# Altium project DARKYDEN.PrjPcb (part 8 of 9)

## Sheet USB2_0.SchDoc: DARKYDEN_USBC2_0
size Letter; ApprovedBy: APPROUVÉ PAR; Author: Harold Malbrouck; Organization: Cegep Limoilou; Address1: 1300, 8e Avenue; Address2: Québec, QC; Address3: Canada; Address4: G1J 5L5; Revision: Rev.C; SheetNumber: 20; SheetTotal: 22
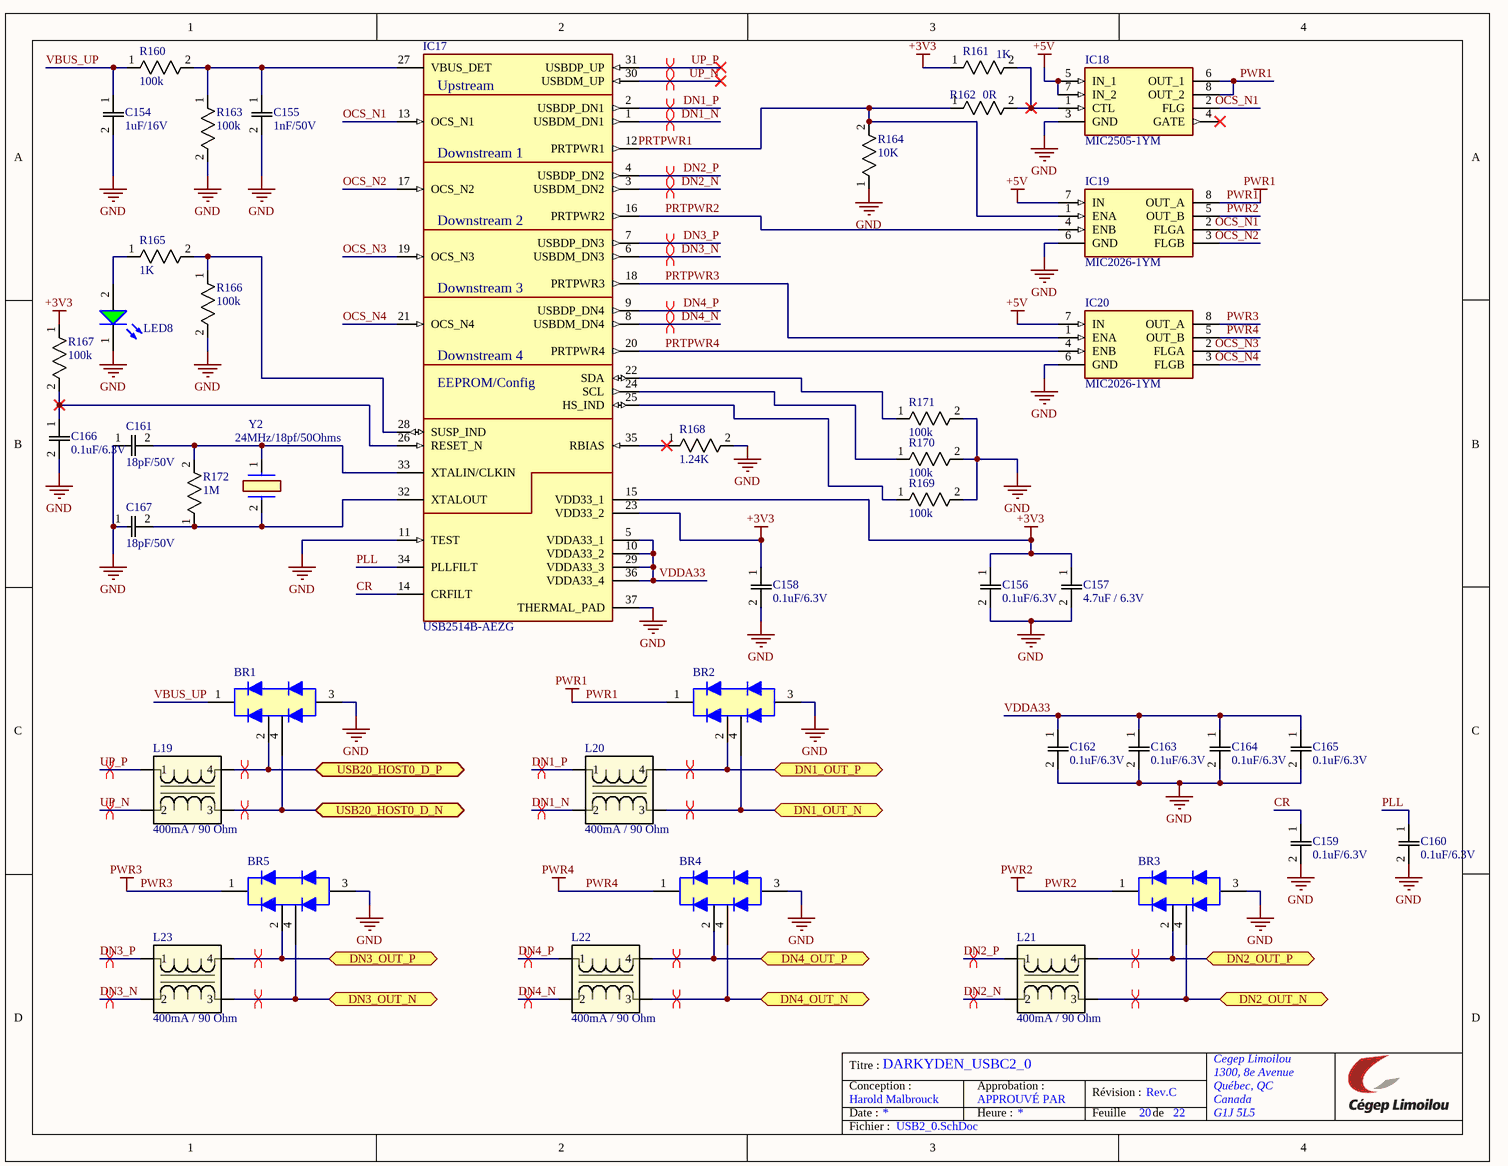
[diagram p9: USB2_0.SchDoc]

### Parts
BR1  BGX50AE6327HTSA1  [BF998215]  (value not drawn)
BR2  BGX50AE6327HTSA1  [BF998215]  (value not drawn)
BR3  BGX50AE6327HTSA1  [BF998215]  (value not drawn)
BR4  BGX50AE6327HTSA1  [BF998215]  (value not drawn)
BR5  BGX50AE6327HTSA1  [BF998215]  (value not drawn)
C154  1uF/16V  [C0805]
C155  1nF/50V  [C0805]
C156  0.1uF/6.3V  [C0805]
C157  4.7uF / 6.3V  [C0805]
C158  0.1uF/6.3V  [C0805]
C159  0.1uF/6.3V  [C0805]
C160  0.1uF/6.3V  [C0805]
C161  18pF/50V  [C0805]
C162  0.1uF/6.3V  [C0805]
C163  0.1uF/6.3V  [C0805]
C164  0.1uF/6.3V  [C0805]
C165  0.1uF/6.3V  [C0805]
C166  0.1uF/6.3V  [C0805]
C167  18pF/50V  [C0805]
IC17  USB2514B-AEZG  [QFN50P600X600X100-37N-D]
IC18  MIC2505-1YM  [SOIC127P599X173-8N]
IC19  MIC2026-1YM  [SOIC127P599X173-8N]
IC20  MIC2026-1YM  [SOIC127P599X173-8N]
L19  400mA / 90 Ohm  [ACM20129002PT002]
L20  400mA / 90 Ohm  [ACM20129002PT002]
L21  400mA / 90 Ohm  [ACM20129002PT002]
L22  400mA / 90 Ohm  [ACM20129002PT002]
L23  400mA / 90 Ohm  [ACM20129002PT002]
LED8  Green, 3.2V, 140°  [WL-SMCD_0603]  (value not drawn)
R160  100k  [RESC1608X55N]
R161  1K  [RESC1608X55N]
R162  0R  [RESC1608X55N]
R163  100k  [RESC1608X55N]
R164  10K  [RESC1608X55N]
R165  1K  [RESC1608X55N]
R166  100k  [RESC1608X55N]
R167  100k  [RESC1608X55N]
R168  1.24K  [RESC1608X55N]
R169  100k  [RESC1608X55N]
R170  100k  [RESC1608X55N]
R171  100k  [RESC1608X55N]
R172  1M  [RESC1608X55N]
Y2  24MHz/18pf/50Ohms  [HCM4924000000ABJT]

### Ports
DN1_OUT_N (bidir, see USB2_0_Connector[3A]), DN1_OUT_P (bidir, see USB2_0_Connector[3A]), DN2_OUT_N (bidir, see USB2_0_Connector[3B]), DN2_OUT_P (bidir, see USB2_0_Connector[3B]), DN3_OUT_N (bidir, see USB2_0_Connector[3C]), DN3_OUT_P (bidir, see USB2_0_Connector[3C]), DN4_OUT_N (bidir, see USB2_0_Connector[3C]), DN4_OUT_P (bidir, see USB2_0_Connector[3C]), USB20_HOST0_D_N (bidir, see CONNECTEUR_4[3A]), USB20_HOST0_D_P (bidir, see CONNECTEUR_4[3A])

### Nets
+3V3: C156.1 C157.1 C158.1 IC17.15(VDD33_1) IC17.23(VDD33_2) R161.1 R167.1
+5V: IC18.5(IN_1) IC18.7(IN_2) IC19.7(IN) IC20.7(IN)
GND: BR1.3(-) BR2.3(-) BR3.3(-) BR4.3(-) BR5.3(-) C154.2 C155.2 C156.2 C157.2 C158.2 C159.2 C160.2 C161.1 C162.2 C163.2 C164.2 C165.2 C166.2 C167.1 IC17.11(TEST) IC17.37(THERMAL_PAD) IC18.3(GND) IC19.6(GND) IC20.6(GND) LED8.1(K) R163.2 R164.1 R166.2 R168.2 R169.2 R170.2 R171.2  [project net AGND]
PWR1: BR2.1(+) IC18.6(OUT_1) IC18.8(OUT_2) IC19.8(OUT_A)
PWR2: BR3.1(+) IC19.5(OUT_B)
PWR3: BR5.1(+) IC20.8(OUT_A)
PWR4: BR4.1(+) IC20.5(OUT_B)
CR: C159.1 IC17.14(CRFILT)
DN1_N: IC17.1(USBDM_DN1) L20.2
DN1_OUT_N: BR2.4(~_2) L20.3 ; port DN1_OUT_N
DN1_OUT_P: BR2.2(~_1) L20.4 ; port DN1_OUT_P
DN1_P: IC17.2(USBDP_DN1) L20.1
DN2_N: IC17.3(USBDM_DN2) L21.2
DN2_OUT_N: BR3.4(~_2) L21.3 ; port DN2_OUT_N
DN2_OUT_P: BR3.2(~_1) L21.4 ; port DN2_OUT_P
DN2_P: IC17.4(USBDP_DN2) L21.1
DN3_N: IC17.6(USBDM_DN3) L23.2
DN3_OUT_N: BR5.4(~_2) L23.3 ; port DN3_OUT_N
DN3_OUT_P: BR5.2(~_1) L23.4 ; port DN3_OUT_P
DN3_P: IC17.7(USBDP_DN3) L23.1
DN4_N: IC17.8(USBDM_DN4) L22.2
DN4_OUT_N: BR4.4(~_2) L22.3 ; port DN4_OUT_N
DN4_OUT_P: BR4.2(~_1) L22.4 ; port DN4_OUT_P
DN4_P: IC17.9(USBDP_DN4) L22.1
OCS_N1: IC17.13(OCS_N1) IC18.2(FLG) IC19.2(FLGA)
OCS_N2: IC17.17(OCS_N2) IC19.3(FLGB)
OCS_N3: IC17.19(OCS_N3) IC20.2(FLGA)
OCS_N4: IC17.21(OCS_N4) IC20.3(FLGB)
PLL: C160.1 IC17.34(PLLFILT)
PRTPWR1: IC17.12(PRTPWR1) IC19.1(ENA) R162.1 R164.2
PRTPWR2: IC17.16(PRTPWR2) IC19.4(ENB)
PRTPWR3: IC17.18(PRTPWR3) IC20.1(ENA)
PRTPWR4: IC17.20(PRTPWR4) IC20.4(ENB)
UP_N: IC17.30(USBDM_UP) L19.2
UP_P: IC17.31(USBDP_UP) L19.1
USB20_HOST0_D_N: BR1.4(~_2) L19.3 ; port USB20_HOST0_D_N
USB20_HOST0_D_P: BR1.2(~_1) L19.4 ; port USB20_HOST0_D_P
VBUS_UP: BR1.1(+) C154.1 R160.1
VDDA33: C162.1 C163.1 C164.1 C165.1 IC17.5(VDDA33_1) IC17.10(VDDA33_2) IC17.29(VDDA33_3) IC17.36(VDDA33_4)
NetC155_1: C155.1 IC17.27(VBUS_DET) R160.2 R163.1
NetC161_2: C161.2 IC17.33(XTALIN/CLKIN) R172.2 Y2.1
NetC166_1: C166.1 IC17.26(RESET_N) R167.2
NetC167_2: C167.2 IC17.32(XTALOUT) R172.1 Y2.2(CRYSTAL_2)
NetIC17_22: IC17.22(SDA) R171.1
NetIC17_24: IC17.24(SCL) R170.1
NetIC17_25: IC17.25(HS_IND) R169.1
NetIC17_28: IC17.28(SUSP_IND) R165.2 R166.1
NetIC17_35: IC17.35(RBIAS) R168.1
NetIC18_1: IC18.1(CTL) R161.2 R162.2
NetLED8_2: LED8.2(A) R165.1

Not connected (* = marked no-connect by the designer): IC18 4(GATE)*

### Layout directives
differential pair: DN1_N, DN1_OUT_N, DN1_OUT_P, DN1_P, DN2_N, DN2_OUT_N, DN2_OUT_P, DN2_P, DN3_N, DN3_OUT_N, DN3_OUT_P, DN3_P, DN4_N, DN4_OUT_N, DN4_OUT_P, DN4_P, UP_N, UP_P, USB20_HOST0_D_N, USB20_HOST0_D_P

### Notes on the sheet
- Titre :
- Conception :
- Date :
- Approbation :
- Heure :
- Révision :
- Feuille
- de
- Fichier :
- (in symbol USB2514B-AEZG) Upstream; Downstream 1; Downstream 2; Downstream 3; Downstream 4; EEPROM/Config

### Library data of the parts
BR1-BR5 = BGX50AE6327HTSA1: BGX50A Series 50 V 140 mA Surface Mount Silicon Switching Diode - SOT-143; Manufacturer_Name: Infineon; Forward Current: 140mA; Forward Voltage: 1.3V; Max Repetitive Reverse Voltage (Vrrm): 70V; Reverse Recovery Time: 6ns; Voltage Rating (DC): 50V; Value: 1.5pF; Max Reverse Current: 200nA; Datasheet Link: https://www.infineon.com/dgdl/Infineon-BGX50ASERIES-DS-v01_01-en.pdf?fileId=db3a30431400ef6801141cc423c404e9; Manufacturer_Part_Number: BGX50AE6327HTSA1; Mouser Part Number: 726-BGX50AE6327HTSA1; Mouser Price/Stock: https://www.mouser.co.uk/ProductDetail/Infineon-Technologies/BGX50AE6327HTSA1?qs=K00xGehIljtICzjrsCDc8w%3D%3D; Arrow Part Number: BGX50AE6327HTSA1; Arrow Price/Stock: https://www.arrow.com/en/products/bgx50ae6327htsa1/infineon-technologies-ag?utm_currency=USD&region=europe; Supplier: Digikey; Supplier Part Number: BGX50AE6327HTSA1CT-ND; Manufacturer: Infineon; Manufacturer Part Number: BGX50AE6327HTSA1; RoHS: Yes; Category: Rectifier Diodes; Stock: 90032; Pricing: 1=0.42, 10=0.266, 100=0.1782, 500=0.13332, 1000=0.1188 (USD); Mounting Technology: Surface Mount; Case/Package: SOT-143-4; Pins: 4; Min Operating Temperature: -65°C; Max Operating Temperature: 150°C; Packaging: Tape and Reel; Series: -; Current Rating: 140mA; Package Quantity: 3000NUMBER; Reverse Voltage: 50V; Length: 2.9mm; Width: 1.3mm; Height: 1.1mm; Radiation Hardening: No; RoHS Compliant: Yes; Lead Free: Lead Free; Halogen Free: Not Halogen Free; Reach SVHC Compliant: 4186SVHC; ComponentLink1URL: http://www.farnell.com/datasheets/1835970.pdf?src-supplier=Farnell; ComponentLink1Description: http://www.farnell.com/datasheets/1835970.pdf?src-supplier=Farnell; ComponentLink2URL: http://uk.rs-online.com/webdocs/132f/0900766b8132f01b.pdf?src-supplier=Rs; ComponentLink2Description: http://uk.rs-online.com/webdocs/132f/0900766b8132f01b.pdf?src-supplier=Rs; ComponentLink3URL: http://components.arrow.com/part/dataview/52117287S9850481N2051?src-supplier=Arrow+Electronics; ComponentLink3Description: http://components.arrow.com/part/dataview/52117287S9850481N2051?src-supplier=Arrow+Electronics; ComponentLink4URL: https://datasheet.octopart.com/BGX50AE6327HTSA1-Infineon-datasheet-180052998.pdf?src-supplier=Element14; ComponentLink4Description: https://datasheet.octopart.com/BGX50AE6327HTSA1-Infineon-datasheet-180052998.pdf?src-supplier=Element14; ComponentLink5URL: http://documents.rs-components.com/techlib://itc_doclist_GB.htm?stockno=0287342A&src-supplier=Rs; ComponentLink5Description: http://documents.rs-components.com/techlib://itc_doclist_GB.htm?stockno=0287342A&src-supplier=Rs; ComponentLink6URL: http://datasheet.octopart.com/BGX50AE6327HTSA1-Infineon-datasheet-5392290.pdf?src-supplier=Future+Electronics; ComponentLink6Description: http://datasheet.octopart.com/BGX50AE6327HTSA1-Infineon-datasheet-5392290.pdf?src-supplier=Future+Electronics; ComponentLink7URL: http://www.farnell.com/datasheets/1835970.pdf?src-supplier=Newark; ComponentLink7Description: http://www.farnell.com/datasheets/1835970.pdf?src-supplier=Newark; ComponentLink8URL: http://datasheet.octopart.com/BGX50AE6327HTSA1-Infineon-datasheet-5392290.pdf?src-supplier=Mouser; ComponentLink8Description: http://datasheet.octopart.com/BGX50AE6327HTSA1-Infineon-datasheet-5392290.pdf?src-supplier=Mouser; ComponentLink9URL: http://www.infineon.com/dgdl/bgx50aseries.pdf?folderId=db3a30431400ef6801141cc1c4cd04e8&fileId=db3a30431400ef6801141cc423c404e9&src-supplier=Avnet; ComponentLink9Description: http://www.infineon.com/dgdl/bgx50aseries.pdf?folderId=db3a30431400ef6801141cc1c4cd04e8&fileId=db3a30431400ef6801141cc423c404e9&src-supplier=Avnet
C154 = C0805C105K4RACTU: 1uF/16 V, X7R, Surface Mount, 0805; Manufacturer_Name: KEMET; Material: 4241ConductorMaterial; Value: 1uF; Tolerance: 10%; Voltage Rating (DC): 16V; Datasheet Link: https://content.kemet.com/datasheets/KEM_C1002_X7R_SMD.pdf; Height: 1.1mm; Manufacturer_Part_Number: C0805C105K4RACTU; Mouser Part Number: 80-C0805C105K4R; Mouser Price/Stock: https://www.mouser.co.uk/ProductDetail/KEMET/C0805C105K4RACTU?qs=yrVqjCObULOefkidH6lLLQ%3D%3D; Arrow Part Number: C0805C105K4RACTU; Arrow Price/Stock: https://www.arrow.com/en/products/c0805c105k4ractu/kemet-corporation?utm_currency=USD&region=nac; Supplier: Digikey; Supplier Part Number: 399-C0805C105K4RACTUCT-ND; Manufacturer: KEMET; Manufacturer Part Number: C0805C105K4RACTU; RoHS: Yes; Category: Ceramic Capacitors; Stock: 422443; Pricing: 1=0.12, 10=0.068, 100=0.041, 1000=0.04021, 2500=0.02182, 5000=0.02051, 7500=0.02038, 12500=0.01866, 17500=0.01858, 25000=0.01797, 62500=0.01676, 125000=0.01602, 250000=0.01544 (USD); Mounting Technology: Surface Mount,PCB; Case/Package: 0805; Pins: 2; Case Code (Metric): 2012; Case Code (Imperial): 0805; Min Operating Temperature: -55°C; Max Operating Temperature: 125°C; Packaging: Tape and Reel; Dielectric: X7R; Package Quantity: 1; Voltage Rating: 16V; Termination: SMD/SMT; Series: SMD Comm X7R; Construction: Flat; Voltage: 16V; Voltage Rating (AC): 16V; Length: 2mm; Width: 0.049inch; Thickness: 0.039inch; Depth: 1.25mm; Radiation Hardening: No; Reach SVHC Compliant: No; RoHS Compliant: Yes; Lead Free: 5697LeadFree; ComponentLink1URL: https://datasheet.ciiva.com/6074/1722731-6074364.pdf?src-supplier=Farnell; ComponentLink1Description: https://datasheet.ciiva.com/6074/1722731-6074364.pdf?src-supplier=Farnell; ComponentLink2URL: https://datasheet.ciiva.com/39122/docfinderpartnumberc0402c102k5ractu-39122926.pdf?src-supplier=Onlinecomponents.com; ComponentLink2Description: https://datasheet.ciiva.com/39122/docfinderpartnumberc0402c102k5ractu-39122926.pdf?src-supplier=Onlinecomponents.com; ComponentLink3URL: https://datasheet.ciiva.com/45846/docfinderpartnumberc0402c102k5ractu-45846934.pdf?src-supplier=Onlinecomponents.com; ComponentLink3Description: https://datasheet.ciiva.com/45846/docfinderpartnumberc0402c102k5ractu-45846934.pdf?src-supplier=Onlinecomponents.com; ComponentLink4URL: https://datasheet.ciiva.com/18193/getdatasheetpartid-331279-18193467.pdf?src-supplier=Verical; ComponentLink4Description: https://datasheet.ciiva.com/18193/getdatasheetpartid-331279-18193467.pdf?src-supplier=Verical; ComponentLink5URL: https://datasheet.ciiva.com/14585/70095383-14585511.pdf?src-supplier=Allied+Electronics; ComponentLink5Description: https://datasheet.ciiva.com/14585/70095383-14585511.pdf?src-supplier=Allied+Electronics; ComponentLink6URL: https://datasheet.ciiva.com/14603/70095383-14603388.pdf?src-supplier=Allied+Electronics; ComponentLink6Description: https://datasheet.ciiva.com/14603/70095383-14603388.pdf?src-supplier=Allied+Electronics; ComponentLink7URL: https://datasheet.ciiva.com/28692/1851736-28692942.pdf?src-supplier=Element14; ComponentLink7Description: https://datasheet.ciiva.com/28692/1851736-28692942.pdf?src-supplier=Element14
C155 = C0805C102K5RACTU: Multilayer Ceramic Capacitor 1000 Pf 50 V ½ 10% X7R 0805 [2012 Metric]; Manufacturer_Name: KEMET; Manufacturer_Part_Number: C0805C102K5RAC-TU; Dielectric Material: 4241ConductorMaterial; Value: 1nF; Voltage Rating (DC): 50V; Temperature Coefficient: 30ppm/°C; Datasheet Link: https://componentsearchengine.com/Datasheets/2/C0805C102K5RAC-TU.pdf; Height: 0.88mm; Supplier: Digikey; Supplier Part Number: 399-C0805C102K5RACTUCT-ND; Manufacturer: KEMET; Manufacturer Part Number: C0805C102K5RACTU; RoHS: Yes; Category: Ceramic Capacitors; Stock: 137971; Pricing: 1=0.11, 10=0.06, 100=0.0358, 1000=0.0235 (USD); Mounting Technology: Surface Mount,PCB; Case/Package: 0805; Pins: 2; Case Code (Imperial): 0805; Case Code (Metric): 2012; Material: 4241ConductorMaterial; Min Operating Temperature: -55°C; Max Operating Temperature: 125°C; Tolerance: 10%; Packaging: Tape and Reel; Dielectric: X7R; Voltage: 50V; Series: SMD Comm X7R; Voltage Rating: 50V; Package Quantity: 4000; Termination: SMD/SMT; Construction: Flat; Length: 2mm; Width: 1.25mm; Lead Pitch: 0.75mm; Depth: 1.25mm; Thickness: 889um; Radiation Hardening: No; Reach SVHC Compliant: No; RoHS Compliant: Yes; Lead Free: 5697LeadFree; ComponentLink1URL: https://datasheet.ciiva.com/18193/getdatasheetpartid-385640-18193338.pdf?src-supplier=Verical; ComponentLink1Description: https://datasheet.ciiva.com/18193/getdatasheetpartid-385640-18193338.pdf?src-supplier=Verical; ComponentLink2URL: https://datasheet.ciiva.com/39122/docfinderpartnumberc0402c102k5ractu-39122922.pdf?src-supplier=Onlinecomponents.com; ComponentLink2Description: https://datasheet.ciiva.com/39122/docfinderpartnumberc0402c102k5ractu-39122922.pdf?src-supplier=Onlinecomponents.com; ComponentLink3URL: https://datasheet.ciiva.com/7842/1918693-7842527.pdf?src-supplier=Element14; ComponentLink3Description: https://datasheet.ciiva.com/7842/1918693-7842527.pdf?src-supplier=Element14
C156 C158-C160 C162-C166 = C0805C104K9RACTU: 0.1uF 6.3V X7R 10% Pad SMD 0805 125C T/R; Manufacturer_Name: KEMET; Dielectric Material: Ceramic; Material: 4241ConductorMaterial; Value: 100nF; Datasheet Link: https://content.kemet.com/datasheets/KEM_C1002_X7R_SMD.pdf; Height: 1.1mm; Manufacturer_Part_Number: C0805C104K9RACTU; Mouser Part Number: 80-C0805C104K9R; Mouser Price/Stock: https://www.mouser.co.uk/ProductDetail/KEMET/C0805C104K9RACTU?qs=jbCUrP3sAgRYLjBU7s5h8Q%3D%3D; Arrow Part Number: C0805C104K9RACTU; Arrow Price/Stock: https://www.arrow.com/en/products/c0805c104k9ractu/kemet-corporation; Supplier: Digikey; Supplier Part Number: 399-C0805C104K9RACTUCT-ND; Manufacturer: KEMET; Manufacturer Part Number: C0805C104K9RACTU; RoHS: Yes; Category: Ceramic Capacitors; Stock: 68008; Pricing: 1=0.21, 10=0.214, 100=0.1506, 1000=0.11154 (USD); Mounting Technology: Surface Mount; Case/Package: 0805; Case Code (Metric): 2012; Case Code (Imperial): 0805; Min Operating Temperature: -55°C; Max Operating Temperature: 125°C; Package Quantity: 4000; Voltage Rating: 6.3V; Tolerance: 10%; Packaging: Tape and Reel; Voltage Rating (DC): 6.3V; Dielectric: X7R; Termination: SMD/SMT; Series: SMD Comm X7R; Construction: Flat; Length: 2mm; Width: 1.2mm; Thickness: 0.039inch; Depth: 1.25mm; Radiation Hardening: No; RoHS Compliant: Yes; ComponentLink1URL: http://www.farnell.com/datasheets/2746329.pdf?src-supplier=Farnell; ComponentLink1Description: http://www.farnell.com/datasheets/2746329.pdf?src-supplier=Farnell; ComponentLink2URL: http://www.mouser.com/ds/2/212/KEM_C1002_X7R_SMD-1102033.pdf?src-supplier=Mouser; ComponentLink2Description: http://www.mouser.com/ds/2/212/KEM_C1002_X7R_SMD-1102033.pdf?src-supplier=Mouser; ComponentLink3URL: http://datasheet.octopart.com/C0805C104K9RACTU-KEMET-datasheet-157246124.pdf?src-supplier=Avnet; ComponentLink3Description: http://datasheet.octopart.com/C0805C104K9RACTU-KEMET-datasheet-157246124.pdf?src-supplier=Avnet; ComponentLink4URL: http://datasheet.octopart.com/C0805C104K9RACTU-KEMET-datasheet-157246124.pdf?src-supplier=Onlinecomponents.com; ComponentLink4Description: http://datasheet.octopart.com/C0805C104K9RACTU-KEMET-datasheet-157246124.pdf?src-supplier=Onlinecomponents.com; ComponentLink5URL: http://capacitoredge.kemet.com/capedge2/DataSheet?pn=C0805C104K9RACTU&src-supplier=Avnet; ComponentLink5Description: http://capacitoredge.kemet.com/capedge2/DataSheet?pn=C0805C104K9RACTU&src-supplier=Avnet; ComponentLink6URL: http://www.farnell.com/datasheets/2746329.pdf?src-supplier=Newark; ComponentLink6Description: http://www.farnell.com/datasheets/2746329.pdf?src-supplier=Newark; ComponentLink7URL: http://datasheet.octopart.com/C0805C104K9RACTU-KEMET-datasheet-157246124.pdf?src-supplier=Digikey; ComponentLink7Description: http://datasheet.octopart.com/C0805C104K9RACTU-KEMET-datasheet-157246124.pdf?src-supplier=Digikey; ComponentLink8URL: https://api.kemet.com/component-edge/download/datasheet/C0805C104K9RACTU.pdf?src-supplier=Digikey; ComponentLink8Description: https://api.kemet.com/component-edge/download/datasheet/C0805C104K9RACTU.pdf?src-supplier=Digikey; ComponentLink9URL: https://datasheet.octopart.com/C0805C104K9RACTU.-KEMET-datasheet-179056791.pdf?src-supplier=Element14; ComponentLink9Description: https://datasheet.octopart.com/C0805C104K9RACTU.-KEMET-datasheet-179056791.pdf?src-supplier=Element14; ComponentLink10URL: https://datasheet.octopart.com/C0805C104K9RACTU-KEMET-datasheet-137357759.pdf?src-supplier=Farnell; ComponentLink10Description: https://datasheet.octopart.com/C0805C104K9RACTU-KEMET-datasheet-137357759.pdf?src-supplier=Farnell; ComponentLink11URL: http://www.farnell.com/datasheets/2746329.pdf?src-supplier=Element14; ComponentLink11Description: http://www.farnell.com/datasheets/2746329.pdf?src-supplier=Element14; ComponentLink12URL: https://datasheet.octopart.com/C0805C104K9RACTU-KEMET-datasheet-157246124.pdf?src-supplier=TME; ComponentLink12Description: https://datasheet.octopart.com/C0805C104K9RACTU-KEMET-datasheet-157246124.pdf?src-supplier=TME; ComponentLink13URL: http://datasheet.octopart.com/C0805C104K9RACTU-KEMET-datasheet-157246124.pdf?src-supplier=TTI; ComponentLink13Description: http://datasheet.octopart.com/C0805C104K9RACTU-KEMET-datasheet-157246124.pdf?src-supplier=TTI; ComponentLink14URL: http://datasheet.octopart.com/C0805C104K9RACTU-KEMET-datasheet-157246124.pdf?src-supplier=Electro+Sonic; ComponentLink14Description: http://datasheet.octopart.com/C0805C104K9RACTU-KEMET-datasheet-157246124.pdf?src-supplier=Electro+Sonic
C157 = C0805C475K9RACTU: 4.7uF 6.3V X7R 10% Pad SMD 0805 125C T/R; Manufacturer_Name: KEMET; Dielectric Material: Ceramic; Datasheet Link: https://content.kemet.com/datasheets/KEM_C1002_X7R_SMD.pdf; Height: 1.1mm; Manufacturer_Part_Number: C0805C475K9RACTU; Mouser Part Number: 80-C0805C475K9R; Mouser Price/Stock: https://www.mouser.co.uk/ProductDetail/KEMET/C0805C475K9RACTU?qs=iP0bYSAMAFr1bFRzk5G%2Fsg%3D%3D; Arrow Part Number: C0805C475K9RACTU; Arrow Price/Stock: https://www.arrow.com/en/products/c0805c475k9ractu/kemet-corporation?region=nac; Supplier: Digikey; Supplier Part Number: 399-C0805C475K9RACTUCT-ND; Manufacturer: KEMET; Manufacturer Part Number: C0805C475K9RACTU; RoHS: Yes; Category: Ceramic Capacitors; Stock: 8898; Pricing: 1=0.47, 10=0.287, 100=0.2342, 1000=0.19866 (USD); Mounting Technology: Surface Mount; Case/Package: 0805; Case Code (Metric): 2012; Case Code (Imperial): 0805; Material: Ceramic; Min Operating Temperature: -55°C; Max Operating Temperature: 125°C; Package Quantity: 1; Value: 4.7uF; Voltage Rating: 6.3V; Tolerance: 10%; Packaging: Tape and Reel; Voltage Rating (DC): 6.3V; Termination: SMD/SMT; Series: C; Length: 0.079inch; Width: 0.049inch; Thickness: 0.055inch; RoHS Compliant: Yes; ComponentLink1URL: https://datasheet.ciiva.com/5410/kem-c1002-x7r-smd-5410071.pdf?src-supplier=Mouser; ComponentLink1Description: https://datasheet.ciiva.com/5410/kem-c1002-x7r-smd-5410071.pdf?src-supplier=Mouser
C161 C167 = C0805C180K5RACTU: 18PF, 50V, Mlcc, 0805;; Manufacturer_Name: KEMET; Dielectric Material: 4241ConductorMaterial; Dielectric: 1511DielectricType; Datasheet Link: https://content.kemet.com/datasheets/KEM_C1002_X7R_SMD.pdf; Height: 1.1mm; Manufacturer_Part_Number: C0805C180K5RACTU; Supplier: Digikey; Supplier Part Number: 399-C0805C180K5RACTUCT-ND; Manufacturer: KEMET; Manufacturer Part Number: C0805C180K5RACTU; RoHS: Yes; Category: Ceramic Capacitors; Stock: 4917; Pricing: 1=0.22, 10=0.124, 100=0.078, 1000=0.05429 (USD); Case/Package: 339Case; Value: 18pF; Voltage Rating (DC): 50V; RoHS Compliant: Yes; ComponentLink1URL: https://datasheet.octopart.com/C0805C180K5RACTU-KEMET-datasheet-149524058.pdf?src-supplier=Farnell; ComponentLink1Description: https://datasheet.octopart.com/C0805C180K5RACTU-KEMET-datasheet-149524058.pdf?src-supplier=Farnell
IC17 = USB2514B-AEZG: USB Hub Controller USB 2.0 USB Interface 36-QFN (6x6); Manufacturer_Name: Microchip; Datasheet Link: http://ww1.microchip.com/downloads/en/DeviceDoc/00001692C.pdf; Height: 1mm; Manufacturer_Part_Number: USB2514B-AEZG; Mouser Part Number: 886-USB2514B-AEZG; Mouser Price/Stock: https://www.mouser.co.uk/ProductDetail/Microchip-Technology/USB2514B-AEZG?qs=ydWXD%252B8LvLCxuNqQPTEcVA%3D%3D; Arrow Part Number: USB2514B-AEZG; Arrow Price/Stock: https://www.arrow.com/en/products/usb2514b-aezg/microchip-technology?utm_currency=USD&region=nac
IC18 = MIC2505-1YM: Power Switch/Driver 1:1 N-Channel 2A 8-SOIC; Manufacturer_Name: Microchip; Datasheet Link: http://ww1.microchip.com/downloads/en/DeviceDoc/20005579A.pdf; Height: 1.73mm; Manufacturer_Part_Number: MIC2505-1YM; Mouser Part Number: 998-MIC2505-1YM; Mouser Price/Stock: https://www.mouser.co.uk/ProductDetail/Microchip-Technology/MIC2505-1YM?qs=aiLzH1moG334fyRlF%2FjkOA%3D%3D; Arrow Part Number: MIC2505-1YM; Arrow Price/Stock: https://www.arrow.com/en/products/mic2505-1ym/microchip-technology?region=nac
IC19 IC20 = MIC2026-1YM: Power Switch/Driver 1:2 N-Channel 1.25A 8-SOIC; Manufacturer_Name: Microchip; Datasheet Link: https://datasheet.datasheetarchive.com/originals/distributors/Datasheets_SAMA/de61a94af7af6e146ce4ec6120a88ebf.pdf; Height: 1.73mm; Manufacturer_Part_Number: MIC2026-1YM; Mouser Part Number: 998-MIC2026-1YM; Mouser Price/Stock: https://www.mouser.co.uk/ProductDetail/Microchip-Technology/MIC2026-1YM?qs=fCMQZLq47kXY18AAaO6axw%3D%3D; Arrow Part Number: MIC2026-1YM; Arrow Price/Stock: https://www.arrow.com/en/products/mic2026-1ym/microchip-technology?utm_currency=USD&region=nac
L19-L23 = ACM2012-900-2P-T002: Ferrite Beads Wirewound Common Mode Filter 90Ohm 100MHz 400mA 0805 T/R; Manufacturer_Name: TDK; Impedance: 90R; Voltage Rating: 50V; Number of Lines: 2; DC Resistance (DCR): 190mR; Shielding: Shielded; Datasheet Link: https://product.tdk.com/system/files/dam/doc/product/emc/emc/cmf_cmc/catalog/cmf_commercial_signal_acm2012_en.pdf; Height: 1.3mm; Manufacturer_Part_Number: ACM2012-900-2P-T002; Mouser Part Number: 810-ACM20129002PT002; Mouser Price/Stock: https://www.mouser.co.uk/ProductDetail/TDK/ACM2012-900-2P-T002?qs=vhEaPADELPHXWaCJFQVZjQ%3D%3D; Arrow Part Number: ACM2012-900-2P-T002; Arrow Price/Stock: https://www.arrow.com/en/products/acm2012-900-2p-t002/tdk?utm_currency=USD&region=europe; Supplier: Digikey; Supplier Part Number: 445-2207-1-ND; Manufacturer: TDK; Manufacturer Part Number: ACM2012-900-2P-T002; RoHS: Yes; Category: Common Mode Chokes; Stock: 26254; Pricing: 1=0.34, 10=0.277, 25=0.2564, 50=0.2416, 100=0.2278, 250=0.21076, 500=0.1987, 1000=0.18735 (USD); Mounting Technology: Surface Mount; Case/Package: 0805; Pins: 4; Case Code (Metric): 2012; Case Code (Imperial): 0805; Core Material: Ferrite; Min Operating Temperature: -40°C; Max Operating Temperature: 85°C; Packaging: Tape and Reel; Package Quantity: 1; Voltage Rating (DC): 50V; Current Rating: 400mA; Max DC Current: 400mA; Termination: SMD/SMT; Test Frequency: 100MHz; Current: 400mA; DC Current: 400mA; Series: ACM; DC Resistance-Max: 190mR; Max Current Rating: 400mA; RMS Current (Irms): 400mA; ESR: 190mR; Coil Resistance: 190mR; Length: 2.2mm; Width: 0.047inch; Depth: 1.4mm; Radiation Hardening: No; Reach SVHC Compliant: No; Military Standard: Not; RoHS Compliant: Yes; Lead Free: 5697LeadFree; ComponentLink1URL: https://datasheet.ciiva.com/26946/getdatasheetpartid-664745-26946491.pdf?src-supplier=Verical; ComponentLink1Description: https://datasheet.ciiva.com/26946/getdatasheetpartid-664745-26946491.pdf?src-supplier=Verical; ComponentLink2URL: https://datasheet.ciiva.com/1127/1750020-1127257.pdf?src-supplier=Element14; ComponentLink2Description: https://datasheet.ciiva.com/1127/1750020-1127257.pdf?src-supplier=Element14; ComponentLink3URL: https://datasheet.ciiva.com/22726/1750020-22726278.pdf?src-supplier=Element14; ComponentLink3Description: https://datasheet.ciiva.com/22726/1750020-22726278.pdf?src-supplier=Element14; ComponentLink4URL: https://datasheet.ciiva.com/28428/1750020-28428616.pdf?src-supplier=Element14; ComponentLink4Description: https://datasheet.ciiva.com/28428/1750020-28428616.pdf?src-supplier=Element14; ComponentLink5URL: https://datasheet.ciiva.com/46450/1750020-46450939.pdf?src-supplier=Element14; ComponentLink5Description: https://datasheet.ciiva.com/46450/1750020-46450939.pdf?src-supplier=Element14; ComponentLink6URL: https://datasheet.ciiva.com/1007/e9712-acm-1007624.pdf?src-supplier=Digikey; ComponentLink6Description: https://datasheet.ciiva.com/1007/e9712-acm-1007624.pdf?src-supplier=Digikey; ComponentLink7URL: https://datasheet.ciiva.com/1007/e9712-acm-1007623.pdf?src-supplier=Digikey; ComponentLink7Description: https://datasheet.ciiva.com/1007/e9712-acm-1007623.pdf?src-supplier=Digikey; ComponentLink8URL: https://datasheet.ciiva.com/1007/e9712-acm-1007625.pdf?src-supplier=Digikey; ComponentLink8Description: https://datasheet.ciiva.com/1007/e9712-acm-1007625.pdf?src-supplier=Digikey; ComponentLink9URL: https://datasheet.ciiva.com/4941/tdk-e9712-acm-332263-4941941.pdf?src-supplier=Mouser; ComponentLink9Description: https://datasheet.ciiva.com/4941/tdk-e9712-acm-332263-4941941.pdf?src-supplier=Mouser; ComponentLink10URL: https://datasheet.ciiva.com/16416/e9712-acm-16416522.pdf?src-supplier=Future+Electronics; ComponentLink10Description: https://datasheet.ciiva.com/16416/e9712-acm-16416522.pdf?src-supplier=Future+Electronics; ComponentLink11URL: https://datasheet.ciiva.com/8498/e9712-acm-8498823.pdf?src-supplier=Avnet; ComponentLink11Description: https://datasheet.ciiva.com/8498/e9712-acm-8498823.pdf?src-supplier=Avnet; ComponentLink12URL: https://datasheet.ciiva.com/16382/e9712-acm-16382582.pdf?src-supplier=Future+Electronics; ComponentLink12Description: https://datasheet.ciiva.com/16382/e9712-acm-16382582.pdf?src-supplier=Future+Electronics
LED8 = GREEN: WL-SMCD Mono-color Chip LED Diffused, SMT, size 0603, Green, 3.2V, 140°; Manufacturer Part Number: 150060GS55040; Manufacturer: Wurth Elektronik; Case/Size Code: 0603; Chip Technology: InGaN; Dominant Wavelength: 525nm; Luminous Intensity: 430mcd; Peak Wavelength: 520nm; Category: Signal LEDs; Match Code: WL-SMCD; ComponentLink1Description: Website Link; ComponentLink1URL: https://www.we-online.com/redexpert/article/150060GS55040?ad; ComponentLink2Description: Datasheet Link; ComponentLink2URL: https://www.we-online.com/redexpert/spec/150060GS55040?ad; Mount: Surface Mount; Operating Temperature Max: 85°C; Operating Temperature Min: -40°C; Packaging: Tape and Reel; Length: 1.6mm; Width: 0.8mm; Height: 0.4mm; Emitting Color: Green; Forward Voltage: 3.2V; Viewing Angle: 140°
R160 R163 R166 R167 R169-R171 = ERJ-3GEYJ104V: 100K Ohm 5%  Res Thick Film 0603 1/10W +/-200ppm/ßC Molded SMD Punched Carrier T/R; Manufacturer_Name: Panasonic; Value: 100kR; Power Rating: 100mW; Voltage Rating: 75V; Temperature Coefficient: 200ppm/°C; Voltage Rating (DC): 50V; Datasheet Link: http://docs-europe.electrocomponents.com/webdocs/13ba/0900766b813ba21b.pdf; Height: 0.55mm; Manufacturer_Part_Number: ERJ-3GEYJ104V; Mouser Part Number: 667-ERJ-3GEYJ104V; Mouser Price/Stock: https://www.mouser.co.uk/ProductDetail/Panasonic/ERJ-3GEYJ104V?qs=66DK8nO8gJC7IhSuep78kw%3D%3D; Arrow Part Number: ERJ-3GEYJ104V; Arrow Price/Stock: https://www.arrow.com/en/products/erj-3geyj104v/panasonic?region=nac; Supplier: Digikey; Supplier Part Number: P100KGCT-ND; Manufacturer: Panasonic; Manufacturer Part Number: ERJ-3GEYJ104V; RoHS: Yes; Category: Chip SMD Resistors; Stock: 248896; Pricing: 1=0.1, 10=0.033, 50=0.02, 100=0.0165, 500=0.01096, 1000=0.00939 (USD); Mounting Technology: Surface Mount; Case/Package: 0603; Case Code (Imperial): 0603; Case Code (Metric): 1608; Weight: 7.1E-05oz; Contact Plating: Tin; Min Operating Temperature: -55°C; Max Operating Temperature: 155°C; Tolerance: 5%; Packaging: Tape and Reel; Package Quantity: 1; Resistor Type: Thick Film; Termination: SMD/SMT; Number of Terminations: 2; Max Power Dissipation: 100mW; Features: Automotive AEC-Q200; Series: ERJ; Construction: Rectangular; Resistance Tolerance: 5%; Technology: THICK FILM; Length: 1.6mm; Width: 0.8mm; Depth: 0.8mm; Reach SVHC Compliant: No; Military Standard: Not; RoHS Compliant: Yes; ComponentLink1URL: https://datasheet.ciiva.com/11809/0900766b80f806dd-11809567.pdf?src-supplier=Rs; ComponentLink1Description: https://datasheet.ciiva.com/11809/0900766b80f806dd-11809567.pdf?src-supplier=Rs; ComponentLink2URL: https://datasheet.ciiva.com/22758/1678796-22758220.pdf?src-supplier=Farnell; ComponentLink2Description: https://datasheet.ciiva.com/22758/1678796-22758220.pdf?src-supplier=Farnell; ComponentLink3URL: https://datasheet.ciiva.com/43460/1678796-43460761.pdf?src-supplier=Farnell; ComponentLink3Description: https://datasheet.ciiva.com/43460/1678796-43460761.pdf?src-supplier=Farnell; ComponentLink4URL: https://datasheet.ciiva.com/24159/aoa0000ce1-37422-24159717.pdf?src-supplier=Mouser; ComponentLink4Description: https://datasheet.ciiva.com/24159/aoa0000ce1-37422-24159717.pdf?src-supplier=Mouser; ComponentLink5URL: https://datasheet.ciiva.com/46380/1678796-46380412.pdf?src-supplier=Element14; ComponentLink5Description: https://datasheet.ciiva.com/46380/1678796-46380412.pdf?src-supplier=Element14; ComponentLink6URL: https://datasheet.ciiva.com/46389/1678796-46389629.pdf?src-supplier=Element14; ComponentLink6Description: https://datasheet.ciiva.com/46389/1678796-46389629.pdf?src-supplier=Element14; ComponentLink7URL: https://datasheet.ciiva.com/27055/1988495-27055706.pdf?src-supplier=Jameco; ComponentLink7Description: https://datasheet.ciiva.com/27055/1988495-27055706.pdf?src-supplier=Jameco; ComponentLink8URL: https://datasheet.ciiva.com/16762/70255313-16762591.pdf?src-supplier=Allied+Electronics; ComponentLink8Description: https://datasheet.ciiva.com/16762/70255313-16762591.pdf?src-supplier=Allied+Electronics; ComponentLink9URL: https://datasheet.ciiva.com/16508/aoa0000ce1-16508383.pdf?src-supplier=Future+Electronics; ComponentLink9Description: https://datasheet.ciiva.com/16508/aoa0000ce1-16508383.pdf?src-supplier=Future+Electronics
R161 R165 = ERJ-3EKF1001V: 1K Ohm 1% 1/10W Res Thick Film 0603 ±100ppm/°C Molded SMD Punched Carrier T/R; Manufacturer_Name: Panasonic; Value: 1kR; Power Rating: 100mW; Voltage Rating: 75V; Datasheet Link: http://industrial.panasonic.com/cdbs/www-data/pdf/RDA0000/AOA0000C86.pdf; Height: 0.55mm; Manufacturer_Part_Number: ERJ-3EKF1001V; Mouser Part Number: 667-ERJ-3EKF1001V; Mouser Price/Stock: https://www.mouser.co.uk/ProductDetail/Panasonic/ERJ-3EKF1001V?qs=H7k1u0Mp9JTM8yQxOuvoDg%3D%3D; Arrow Part Number: ERJ-3EKF1001V; Arrow Price/Stock: https://www.arrow.com/en/products/erj-3ekf1001v/panasonic?utm_currency=USD&region=europe; Supplier: Digikey; Supplier Part Number: P1.00KHCT-ND; Manufacturer: Panasonic; Manufacturer Part Number: ERJ-3EKF1001V; RoHS: Yes; Category: Chip SMD Resistors; Stock: 1610348; Pricing: 1=0.1, 10=0.035, 100=0.0177, 1000=0.01014, 2500=0.00847 (USD); Mounting Technology: Surface Mount; Case/Package: 0603; Pins: 2; Case Code (Metric): 1608; Case Code (Imperial): 0603; Contact Plating: Tin; Min Operating Temperature: -55°C; Max Operating Temperature: 155°C; Tolerance: 1%; Temperature Coefficient: 100ppm/°C; Packaging: Tape and Reel; Package Quantity: 5000; Resistor Type: Thick Film; Number of Terminations: 2; Termination: SMD/SMT; Max Power Dissipation: 100mW; Voltage Rating (DC): 75V; Features: Automotive AEC-Q200; Series: ERJ; Technology: THICK FILM; Construction: Rectangular; Resistance Tolerance: 1%; Length: 1.6mm; Width: 0.8mm; Depth: 0.8mm; Radiation Hardening: No; Reach SVHC Compliant: No; Military Standard: Not; RoHS Compliant: Yes; ComponentLink1URL: https://datasheet.ciiva.com/48530/aoa0000ce2-48530987.pdf?src-supplier=Avnet; ComponentLink1Description: https://datasheet.ciiva.com/48530/aoa0000ce2-48530987.pdf?src-supplier=Avnet; ComponentLink2URL: https://datasheet.ciiva.com/30063/aoa0000ce2-30063390.pdf?src-supplier=Onlinecomponents.com; ComponentLink2Description: https://datasheet.ciiva.com/30063/aoa0000ce2-30063390.pdf?src-supplier=Onlinecomponents.com; ComponentLink3URL: https://datasheet.ciiva.com/16449/aoa0000ce2-16449065.pdf?src-supplier=Future+Electronics; ComponentLink3Description: https://datasheet.ciiva.com/16449/aoa0000ce2-16449065.pdf?src-supplier=Future+Electronics; ComponentLink4URL: https://datasheet.ciiva.com/22673/1678782-22673918.pdf?src-supplier=Element14; ComponentLink4Description: https://datasheet.ciiva.com/22673/1678782-22673918.pdf?src-supplier=Element14; ComponentLink5URL: https://datasheet.ciiva.com/16768/70260748-16768437.pdf?src-supplier=Allied+Electronics; ComponentLink5Description: https://datasheet.ciiva.com/16768/70260748-16768437.pdf?src-supplier=Allied+Electronics; ComponentLink6URL: https://datasheet.ciiva.com/16774/70260748-16774550.pdf?src-supplier=Allied+Electronics; ComponentLink6Description: https://datasheet.ciiva.com/16774/70260748-16774550.pdf?src-supplier=Allied+Electronics; ComponentLink7URL: https://datasheet.ciiva.com/46373/1678782-46373339.pdf?src-supplier=Element14; ComponentLink7Description: https://datasheet.ciiva.com/46373/1678782-46373339.pdf?src-supplier=Element14; ComponentLink8URL: https://datasheet.ciiva.com/46373/1678782-46373340.pdf?src-supplier=Element14; ComponentLink8Description: https://datasheet.ciiva.com/46373/1678782-46373340.pdf?src-supplier=Element14; ComponentLink9URL: https://datasheet.ciiva.com/7942/aoa0000ce2-7942427.pdf?src-supplier=Element14; ComponentLink9Description: https://datasheet.ciiva.com/7942/aoa0000ce2-7942427.pdf?src-supplier=Element14; ComponentLink10URL: https://datasheet.ciiva.com/9198/aoa0000ce2-9198923.pdf?src-supplier=Avnet; ComponentLink10Description: https://datasheet.ciiva.com/9198/aoa0000ce2-9198923.pdf?src-supplier=Avnet; ComponentLink11URL: https://datasheet.ciiva.com/24070/aoa0000ce2-24070269.pdf?src-supplier=Mouser; ComponentLink11Description: https://datasheet.ciiva.com/24070/aoa0000ce2-24070269.pdf?src-supplier=Mouser
R162 = ERJ-3GEY0R00V: Zero Ohm Resistor, Jumper, 0603 [1608 Metric], Thick Film, 100 mW, 1 A, Surface Mount; Manufacturer_Name: Panasonic; Power Rating: 100mW; Voltage Rating: 75V; Tolerance: 0%; Temperature Coefficient: 200ppm/°C; Datasheet Link: http://docs-europe.electrocomponents.com/webdocs/13ba/0900766b813ba21b.pdf; Height: 0.55mm; Manufacturer_Part_Number: ERJ-3GEY0R00V; Mouser Part Number: 667-ERJ-3GEY0R00V; Mouser Price/Stock: https://www.mouser.co.uk/ProductDetail/Panasonic/ERJ-3GEY0R00V?qs=66DK8nO8gJALIOqOWgiVwg%3D%3D; Arrow Part Number: ERJ-3GEY0R00V; Arrow Price/Stock: https://www.arrow.com/en/products/erj3gey0r00v/panasonic?region=europe; Supplier: Digikey; Supplier Part Number: P0.0GCT-ND; Manufacturer: Panasonic; Manufacturer Part Number: ERJ-3GEY0R00V; RoHS: Yes; Category: Chip SMD Resistors; Stock: 766631; Pricing: 1=0.1, 10=0.02, 25=0.0164, 50=0.0144, 100=0.0126, 250=0.0106, 500=0.00936, 1000=0.0083 (USD); Mounting Technology: Surface Mount; Case/Package: 0603; Case Code (Metric): 1608; Case Code (Imperial): 0603; Contact Plating: Tin; Min Operating Temperature: -55°C; Max Operating Temperature: 155°C; Packaging: Tape and Reel; Package Quantity: 5000; Value: 0R; Resistor Type: Thick Film; Number of Terminations: 2; Termination: SMD/SMT; Max Power Dissipation: 100mW; Features: Automotive AEC-Q200; Series: ERJ; Construction: Rectangular; Technology: THICK FILM; Length: 1.6mm; Width: 0.8mm; Depth: 0.8mm; Ratings: AEC-Q200; Radiation Hardening: No; Reach SVHC Compliant: No; Military Standard: Not; RoHS Compliant: Yes; Lead Free: 5697LeadFree; ComponentLink1URL: https://datasheet.ciiva.com/11808/0900766b80f806dd-11808207.pdf?src-supplier=Rs; ComponentLink1Description: https://datasheet.ciiva.com/11808/0900766b80f806dd-11808207.pdf?src-supplier=Rs; ComponentLink2URL: https://datasheet.ciiva.com/27055/1935748-27055113.pdf?src-supplier=Jameco; ComponentLink2Description: https://datasheet.ciiva.com/27055/1935748-27055113.pdf?src-supplier=Jameco; ComponentLink3URL: https://datasheet.ciiva.com/5959/1678796-5959707.pdf?src-supplier=Farnell; ComponentLink3Description: https://datasheet.ciiva.com/5959/1678796-5959707.pdf?src-supplier=Farnell; ComponentLink4URL: https://datasheet.ciiva.com/43460/1678796-43460647.pdf?src-supplier=Farnell; ComponentLink4Description: https://datasheet.ciiva.com/43460/1678796-43460647.pdf?src-supplier=Farnell; ComponentLink5URL: https://datasheet.ciiva.com/48532/aoa0000ce1-48532165.pdf?src-supplier=Avnet; ComponentLink5Description: https://datasheet.ciiva.com/48532/aoa0000ce1-48532165.pdf?src-supplier=Avnet; ComponentLink6URL: https://datasheet.ciiva.com/28695/1678796-28695833.pdf?src-supplier=Element14; ComponentLink6Description: https://datasheet.ciiva.com/28695/1678796-28695833.pdf?src-supplier=Element14; ComponentLink7URL: https://datasheet.ciiva.com/16834/aoa0000ce1-16834828.pdf?src-supplier=Future+Electronics; ComponentLink7Description: https://datasheet.ciiva.com/16834/aoa0000ce1-16834828.pdf?src-supplier=Future+Electronics; ComponentLink8URL: https://datasheet.ciiva.com/16758/70255313-16758527.pdf?src-supplier=Allied+Electronics; ComponentLink8Description: https://datasheet.ciiva.com/16758/70255313-16758527.pdf?src-supplier=Allied+Electronics; ComponentLink9URL: https://datasheet.ciiva.com/30199/4aoa0000ce1-30199822.pdf?src-supplier=Onlinecomponents.com; ComponentLink9Description: https://datasheet.ciiva.com/30199/4aoa0000ce1-30199822.pdf?src-supplier=Onlinecomponents.com; ComponentLink10URL: https://datasheet.ciiva.com/46377/1678796-46377868.pdf?src-supplier=Element14; ComponentLink10Description: https://datasheet.ciiva.com/46377/1678796-46377868.pdf?src-supplier=Element14; ComponentLink11URL: https://datasheet.ciiva.com/9198/aoa0000ce1-9198975.pdf?src-supplier=Avnet; ComponentLink11Description: https://datasheet.ciiva.com/9198/aoa0000ce1-9198975.pdf?src-supplier=Avnet
R164 = ERJ-3GEYJ103V: 10K Ohm 5% Res Thick Film 0603  0.1W(1/10W) ±200ppm/C Pad SMD Automotive T/R; Manufacturer_Name: Panasonic; Value: 10kR; Temperature Coefficient: 200ppm/°C; Power Rating: 100mW; Voltage Rating: 75V; Datasheet Link: http://docs-europe.electrocomponents.com/webdocs/13ba/0900766b813ba21b.pdf; Height: 0.55mm; Manufacturer_Part_Number: ERJ-3GEYJ103V; Mouser Part Number: 667-ERJ-3GEYJ103V; Mouser Price/Stock: https://www.mouser.co.uk/ProductDetail/Panasonic/ERJ-3GEYJ103V?qs=66DK8nO8gJBWgc%252B0VNNxzg%3D%3D; Arrow Part Number: ERJ-3GEYJ103V; Arrow Price/Stock: https://www.arrow.com/en/products/erj-3geyj103v/panasonic?region=europe; Supplier: Digikey; Supplier Part Number: P10KGCT-ND; Manufacturer: Panasonic; Manufacturer Part Number: ERJ-3GEYJ103V; RoHS: Yes; Category: Chip SMD Resistors; Stock: 2191587; Pricing: 1=0.1, 10=0.033, 50=0.02, 100=0.0165, 500=0.01096, 1000=0.00939 (USD); Mounting Technology: Surface Mount; Case/Package: 0603; Case Code (Imperial): 0603; Case Code (Metric): 1608; Weight: 7.1E-05oz; Contact Plating: Tin; Min Operating Temperature: -55°C; Max Operating Temperature: 155°C; Tolerance: 5%; Packaging: Tape and Reel; Technology: THICK FILM; Package Quantity: 1; Resistor Type: Thick Film; Termination: SMD/SMT; Number of Terminations: 2; Max Power Dissipation: 100mW; Working Voltage: 75V; Features: Automotive AEC-Q200; Series: ERJ; Construction: Rectangular; Resistance Tolerance: 5%; Length: 1.6mm; Width: 0.8mm; Depth: 0.8mm; Reach SVHC Compliant: No; Military Standard: Not; Lead Free: Lead Free; RoHS Compliant: Yes; ComponentLink1URL: https://datasheet.ciiva.com/11809/0900766b80f806dd-11809566.pdf?src-supplier=Rs; ComponentLink1Description: https://datasheet.ciiva.com/11809/0900766b80f806dd-11809566.pdf?src-supplier=Rs; ComponentLink2URL: https://datasheet.ciiva.com/34303/2007265-34303757.pdf?src-supplier=Jameco; ComponentLink2Description: https://datasheet.ciiva.com/34303/2007265-34303757.pdf?src-supplier=Jameco; ComponentLink3URL: https://datasheet.ciiva.com/48531/aoa0000ce1-48531887.pdf?src-supplier=Avnet; ComponentLink3Description: https://datasheet.ciiva.com/48531/aoa0000ce1-48531887.pdf?src-supplier=Avnet; ComponentLink4URL: https://datasheet.ciiva.com/9117/aoa0000ce1-9117038.pdf?src-supplier=Avnet; ComponentLink4Description: https://datasheet.ciiva.com/9117/aoa0000ce1-9117038.pdf?src-supplier=Avnet; ComponentLink5URL: https://datasheet.ciiva.com/28514/1678796-28514213.pdf?src-supplier=Element14; ComponentLink5Description: https://datasheet.ciiva.com/28514/1678796-28514213.pdf?src-supplier=Element14; ComponentLink6URL: https://datasheet.ciiva.com/46371/1678796-46371909.pdf?src-supplier=Element14; ComponentLink6Description: https://datasheet.ciiva.com/46371/1678796-46371909.pdf?src-supplier=Element14; ComponentLink7URL: https://datasheet.ciiva.com/46385/1678796-46385240.pdf?src-supplier=Element14; ComponentLink7Description: https://datasheet.ciiva.com/46385/1678796-46385240.pdf?src-supplier=Element14; ComponentLink8URL: https://datasheet.ciiva.com/24133/aoa0000ce1-37422-24133064.pdf?src-supplier=Mouser; ComponentLink8Description: https://datasheet.ciiva.com/24133/aoa0000ce1-37422-24133064.pdf?src-supplier=Mouser; ComponentLink9URL: https://datasheet.ciiva.com/16740/aoa0000ce1-16740655.pdf?src-supplier=Future+Electronics; ComponentLink9Description: https://datasheet.ciiva.com/16740/aoa0000ce1-16740655.pdf?src-supplier=Future+Electronics; ComponentLink10URL: https://datasheet.ciiva.com/30147/4aoa0000ce1-30147029.pdf?src-supplier=Onlinecomponents.com; ComponentLink10Description: https://datasheet.ciiva.com/30147/4aoa0000ce1-30147029.pdf?src-supplier=Onlinecomponents.com
R168 = ERJ-3EKF1241V: 1.24K Ohm 1% 1/10W  0603; Manufacturer_Name: Panasonic; Description: Thick Film Resistors - SMD 0603 1.24Kohms 1% AEC-Q200; Value: 1.24kR; Power Rating: 100mW; Voltage Rating: 75V; Temperature Coefficient: 100ppm/°C; Voltage Rating (DC): 50V; Datasheet Link: http://industrial.panasonic.com/cdbs/www-data/pdf/RDA0000/AOA0000C86.pdf; Height: 0.55mm; Manufacturer_Part_Number: ERJ-3EKF1241V; Mouser Part Number: 667-ERJ-3EKF1241V; Mouser Price/Stock: https://www.mouser.co.uk/ProductDetail/Panasonic/ERJ-3EKF1241V?qs=H7k1u0Mp9JSxP0pMBm%2FrfQ%3D%3D; Supplier: Digikey; Supplier Part Number: P1.24KHCT-ND; Manufacturer: Panasonic; Manufacturer Part Number: ERJ-3EKF1241V; RoHS: Yes; Category: Chip SMD Resistors; Stock: 87035; Pricing: 1=0.1, 10=0.035, 100=0.0177, 1000=0.01014, 2500=0.00888 (USD); Mounting Technology: Surface Mount; Case/Package: 0603; Case Code (Metric): 1608; Case Code (Imperial): 0603; Contact Plating: Tin; Min Operating Temperature: -55°C; Max Operating Temperature: 155°C; Tolerance: 1%; Packaging: Tape and Reel; Package Quantity: 5000; Resistor Type: Thick Film; Number of Terminations: 2; Termination: SMD/SMT; Max Power Dissipation: 100mW; Features: Automotive AEC-Q200; Series: ERJ; Construction: Rectangular; Resistance Tolerance: 1%; Length: 1.6mm; Width: 0.8mm; Depth: 0.8mm; Radiation Hardening: No; Military Standard: Not; Lead Free: Lead Free; RoHS Compliant: Yes; Reach SVHC Compliant: Unknown; ComponentLink1URL: https://datasheet.ciiva.com/6201/426256-6201385.pdf?src-supplier=Farnell; ComponentLink1Description: https://datasheet.ciiva.com/6201/426256-6201385.pdf?src-supplier=Farnell; ComponentLink2URL: https://datasheet.ciiva.com/43460/426256-43460475.pdf?src-supplier=Farnell; ComponentLink2Description: https://datasheet.ciiva.com/43460/426256-43460475.pdf?src-supplier=Farnell; ComponentLink3URL: https://datasheet.ciiva.com/9198/aoa0000ce2-9198405.pdf?src-supplier=Avnet; ComponentLink3Description: https://datasheet.ciiva.com/9198/aoa0000ce2-9198405.pdf?src-supplier=Avnet; ComponentLink4URL: https://datasheet.ciiva.com/46377/426256-46377543.pdf?src-supplier=Element14; ComponentLink4Description: https://datasheet.ciiva.com/46377/426256-46377543.pdf?src-supplier=Element14; ComponentLink5URL: https://datasheet.ciiva.com/46389/426256-46389400.pdf?src-supplier=Element14; ComponentLink5Description: https://datasheet.ciiva.com/46389/426256-46389400.pdf?src-supplier=Element14; ComponentLink6URL: https://datasheet.ciiva.com/27055/1987599-27055669.pdf?src-supplier=Jameco; ComponentLink6Description: https://datasheet.ciiva.com/27055/1987599-27055669.pdf?src-supplier=Jameco; ComponentLink7URL: https://datasheet.ciiva.com/30129/aoa0000ce2-30129916.pdf?src-supplier=Onlinecomponents.com; ComponentLink7Description: https://datasheet.ciiva.com/30129/aoa0000ce2-30129916.pdf?src-supplier=Onlinecomponents.com; ComponentLink8URL: https://datasheet.ciiva.com/28536/1678782-28536153.pdf?src-supplier=Element14; ComponentLink8Description: https://datasheet.ciiva.com/28536/1678782-28536153.pdf?src-supplier=Element14; ComponentLink9URL: https://datasheet.ciiva.com/28672/1678782-28672318.pdf?src-supplier=Element14; ComponentLink9Description: https://datasheet.ciiva.com/28672/1678782-28672318.pdf?src-supplier=Element14; ComponentLink10URL: https://datasheet.ciiva.com/16787/70260748-16787720.pdf?src-supplier=Allied+Electronics; ComponentLink10Description: https://datasheet.ciiva.com/16787/70260748-16787720.pdf?src-supplier=Allied+Electronics
R172 = ERJ-3GEYJ105V: 1M Ohm Res Thick Film 0603 5% 0.1W(1/10W) +/-200ppm/ßC SMD Automotive T/R; Manufacturer_Name: Panasonic; Value: 1MR; Power Rating: 100mW; Voltage Rating: 75V; Temperature Coefficient: 200ppm/°C; Datasheet Link: http://docs-europe.electrocomponents.com/webdocs/13ba/0900766b813ba21b.pdf; Height: 0.55mm; Manufacturer_Part_Number: ERJ-3GEYJ105V; Mouser Part Number: 667-ERJ-3GEYJ105V; Mouser Price/Stock: https://www.mouser.co.uk/ProductDetail/Panasonic/ERJ-3GEYJ105V?qs=66DK8nO8gJAFuT6JGu2rQw%3D%3D; Arrow Part Number: ERJ-3GEYJ105V; Arrow Price/Stock: https://www.arrow.com/en/products/erj-3geyj105v/panasonic?region=nac; Supplier: Digikey; Supplier Part Number: P1.0MGCT-ND; Manufacturer: Panasonic; Manufacturer Part Number: ERJ-3GEYJ105V; RoHS: Yes; Category: Chip SMD Resistors; Stock: 339054; Pricing: 1=0.1, 10=0.033, 50=0.02, 100=0.0165, 500=0.01096, 1000=0.00939 (USD); Mounting Technology: Surface Mount; Case/Package: 0603; Case Code (Imperial): 0603; Case Code (Metric): 1608; Weight: 7.1E-05oz; Contact Plating: Tin; Min Operating Temperature: -55°C; Max Operating Temperature: 155°C; Packaging: Tape and Reel; Tolerance: 5%; Package Quantity: 1; Resistor Type: Thick Film; Termination: SMD/SMT; Number of Terminations: 2; Max Power Dissipation: 100mW; Features: Automotive AEC-Q200; Series: ERJ; Resistance Tolerance: 5%; Construction: Rectangular; Technology: THICK FILM; Length: 1.6mm; Width: 0.8mm; Depth: 0.8mm; Radiation Hardening: No; Military Standard: Not; Lead Free: Lead Free; RoHS Compliant: Yes; Reach SVHC Compliant: Unknown; ComponentLink1URL: https://datasheet.ciiva.com/11821/0900766b80f806dd-11821431.pdf?src-supplier=Rs; ComponentLink1Description: https://datasheet.ciiva.com/11821/0900766b80f806dd-11821431.pdf?src-supplier=Rs; ComponentLink2URL: https://datasheet.ciiva.com/24160/aoa0000ce1-37422-24160165.pdf?src-supplier=Mouser; ComponentLink2Description: https://datasheet.ciiva.com/24160/aoa0000ce1-37422-24160165.pdf?src-supplier=Mouser; ComponentLink3URL: https://datasheet.ciiva.com/9117/aoa0000ce1-9117049.pdf?src-supplier=Avnet; ComponentLink3Description: https://datasheet.ciiva.com/9117/aoa0000ce1-9117049.pdf?src-supplier=Avnet
Y2 = HCM4924000000ABJT: Crystal 24MHz ±30ppm (Tol) ±50ppm (Stability) 18pF FUND 50Ohm Automotive 2-Pin HC-49/US SMD T/R; Manufacturer_Name: CITIZEN FINEDEVICE; Manufacturer: Citizen; ESR (Equivalent Series Resistance): 50R; Datasheet Link: http://cfd.citizen.co.jp/english/prod-tech/product/pdf/datasheet_AT/HCM49_E.pdf; Height: 4.3mm; Manufacturer_Part_Number: HCM4924000000ABJT; Mouser Part Number: 695-HCM4924.0ABJT; Mouser Price/Stock: https://www.mouser.co.uk/ProductDetail/Citizen-FineDevice/HCM4924000000ABJT?qs=byeeYqUIh0Mz0GkevvEzSA%3D%3D; Supplier: Digikey; Supplier Part Number: 300-6145-1-ND; Manufacturer Part Number: HCM4924000000ABJT; RoHS: Yes; Category: Crystals; Stock: 24350; Pricing: 1=0.54, 10=0.47, 50=0.4262, 100=0.4085, 500=0.37032 (USD); Mounting Technology: Surface Mount; Min Operating Temperature: -10°C; Max Operating Temperature: 60°C; Frequency Tolerance: 30ppm; Load Capacitance: 18pF; Frequency: 24MHz; Series: HCM49; Packaging: Cut Tape; Frequency Stability: 50ppm; Operating Frequency: 24 MHz; Lead Free: Lead Free; RoHS Compliant: Yes; ComponentLink1URL: https://datasheet.ciiva.com/16377/hcm49-16377455.pdf?src-supplier=Future+Electronics; ComponentLink1Description: https://datasheet.ciiva.com/16377/hcm49-16377455.pdf?src-supplier=Future+Electronics